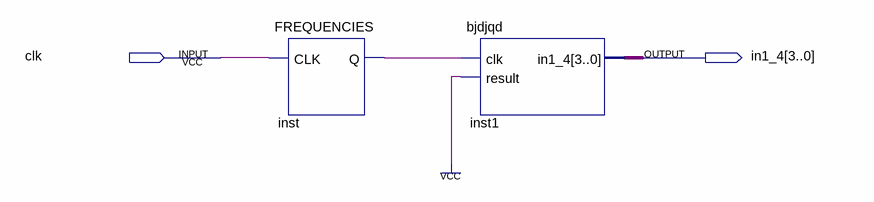
[diagram p0: schematic sheet]
// Quartus schematic block2.bdf as structural Verilog: 2 symbols, 2 pins
module block2 (
  input  clk,
  output [3:0] in1_4
);

  wire inst_q;

  FREQUENCIES inst (.CLK(clk), .Q(inst_q));
  bjdjqd inst1 (.clk(inst_q), .result(1'b1), .in1_4(in1_4));
endmodule
